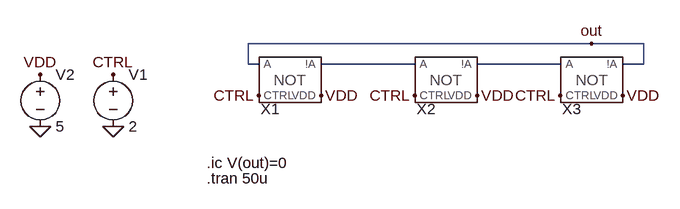
[diagram p0: schematic clk.asc]
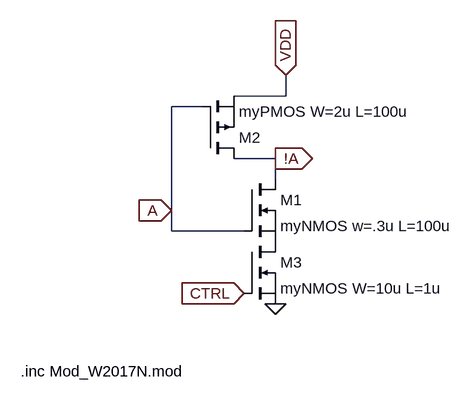
[diagram p1: sub-circuit gate_starved_inverter.asc]
clk.asc, the LTspice schematic file:
Version 4
SHEET 1 2856 680
WIRE 256 80 -272 80
WIRE 336 80 256 80
WIRE -272 112 -272 80
WIRE -256 112 -272 112
WIRE -16 112 -160 112
WIRE 208 112 80 112
WIRE 336 112 336 80
WIRE 336 112 304 112
FLAG -160 160 VDD
FLAG -256 160 CTRL
FLAG -480 208 0
FLAG -480 128 CTRL
FLAG -592 208 0
FLAG -592 128 VDD
FLAG 80 160 VDD
FLAG -16 160 CTRL
FLAG 304 160 VDD
FLAG 208 160 CTRL
FLAG 256 80 out
SYMBOL Gate_Starved_Inverter -208 144 R0
SYMATTR InstName X1
SYMBOL voltage -480 112 R0
WINDOW 123 0 0 Left 2
WINDOW 39 0 0 Left 2
SYMATTR InstName V1
SYMATTR Value 2
SYMBOL voltage -592 112 R0
WINDOW 123 0 0 Left 2
WINDOW 39 0 0 Left 2
SYMATTR InstName V2
SYMATTR Value 5
SYMBOL Gate_Starved_Inverter 32 144 R0
SYMATTR InstName X2
SYMBOL Gate_Starved_Inverter 256 144 R0
SYMATTR InstName X3
TEXT -336 288 Left 2 !.tran 50u
TEXT -336 264 Left 2 !.ic V(out)=0

gate_starved_inverter.asc, the sub-circuit schematic file:
Version 4
SHEET 1 880 680
WIRE 64 -112 64 -144
WIRE 64 -112 -16 -112
WIRE -64 -96 -112 -96
WIRE 48 -16 -16 -16
WIRE 48 16 48 -16
WIRE -112 64 -112 -96
WIRE -112 96 -112 64
WIRE 0 96 -112 96
FLAG -112 64 A
IOPIN -112 64 In
FLAG 48 -16 !A
IOPIN 48 -16 Out
FLAG 64 -144 VDD
IOPIN 64 -144 In
FLAG 48 208 0
FLAG 0 192 CTRL
IOPIN 0 192 In
SYMBOL nmos 0 16 R0
SYMATTR InstName M1
SYMATTR Value myNMOS w=.3u L=100u
SYMBOL pmos -64 -16 M180
SYMATTR InstName M2
SYMATTR Value myPMOS W=2u L=100u
SYMBOL nmos 0 112 R0
SYMATTR InstName M3
SYMATTR Value myNMOS W=10u L=1u
TEXT -344 312 Left 2 !.inc Mod_W2017N.mod

The netlist it stands for:
* clk.asc
XX1 out VDD N001 CTRL gate_starved_inverter
V1 CTRL 0 2
V2 VDD 0 5
XX2 N001 VDD N002 CTRL gate_starved_inverter
XX3 N002 VDD out CTRL gate_starved_inverter

* block symbol definitions
.subckt gate_starved_inverter A VDD !A CTRL
M1 !A A P001 P001 myNMOS w=.3u L=100u
M2 !A A VDD VDD myPMOS W=2u L=100u
M3 P001 CTRL 0 0 myNMOS W=10u L=1u
.inc Mod_W2017N.mod
.ends gate_starved_inverter

.model NMOS NMOS
.model PMOS PMOS
.lib standard.mos
.tran 50u
.ic V(out)=0
.backanno
.end